# Altium schematic sheet usbaxe.SchDoc: USB-Axe
size A; DrawnBy: Evan Custodio; Engineer: Evan Custodio; DocumentNumber: RNG-0004; SheetNumber: 1; SheetTotal: 1
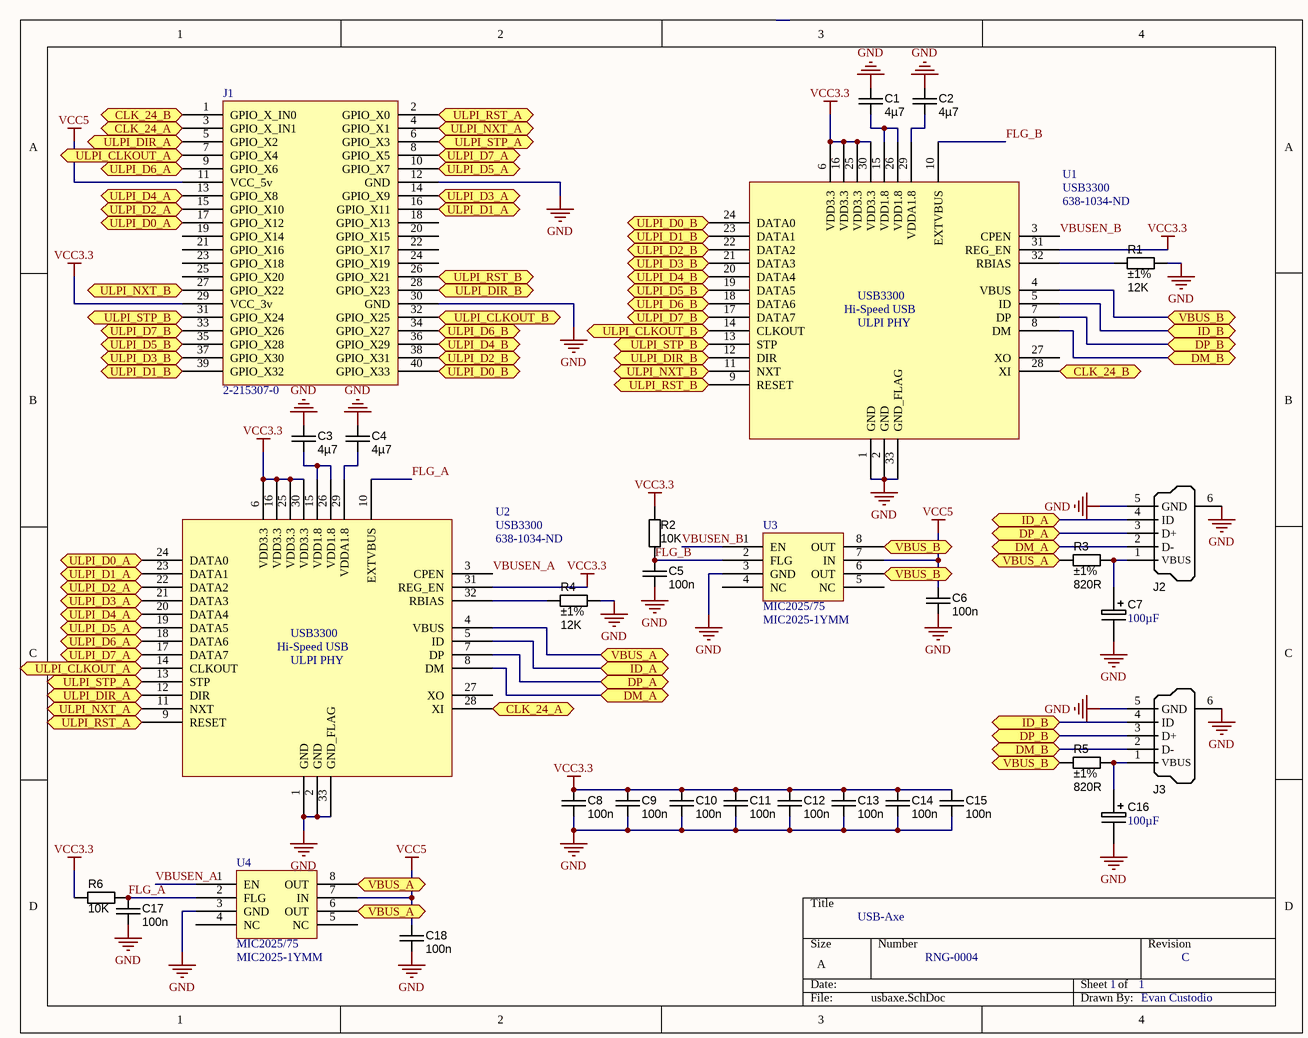
[diagram p0: usbaxe.SchDoc]

## Parts
?  RNGD_logo  (value not drawn)
C1  value 4µ7  [CAPC2012X135N]  (hidden comment: approved sub OK)
C2  value 4µ7  [CAPC2012X135N]  (hidden comment: approved sub OK)
C3  value 4µ7  [CAPC2012X135N]  (hidden comment: approved sub OK)
C4  value 4µ7  [CAPC2012X135N]  (hidden comment: approved sub OK)
C5  value 100n  [CAPC1608X90N]  (hidden comment: approved sub OK)
C6  value 100n  [CAPC1608X90N]  (hidden comment: approved sub OK)
C7  Capacitance: 100µF  [CAPMP3528X210N]
C8  value 100n  [CAPC1608X90N]  (hidden comment: approved sub OK)
C9  value 100n  [CAPC1608X90N]  (hidden comment: approved sub OK)
C10  value 100n  [CAPC1608X90N]  (hidden comment: approved sub OK)
C11  value 100n  [CAPC1608X90N]  (hidden comment: approved sub OK)
C12  value 100n  [CAPC1608X90N]  (hidden comment: approved sub OK)
C13  value 100n  [CAPC1608X90N]  (hidden comment: approved sub OK)
C14  value 100n  [CAPC1608X90N]  (hidden comment: approved sub OK)
C15  value 100n  [CAPC1608X90N]  (hidden comment: approved sub OK)
C16  Capacitance: 100µF  [CAPMP3528X210N]
C17  value 100n  [CAPC1608X90N]  (hidden comment: approved sub OK)
C18  value 100n  [CAPC1608X90N]  (hidden comment: approved sub OK)
J1  2-215307-0  [RCPT_40POS]
J2  USB_Mini-B_TH  [USB_MINI-B_WURTH-TH]  (value not drawn)
J3  USB_Mini-B_TH  [USB_MINI-B_WURTH-TH]  (value not drawn)
R1  value 12K  Tolerance: ±1%  [RESC1608X55N]  (hidden comment: Thick Film)
R2  value 10K  [RESC1608X55N]  (hidden comment: Thick Film)
R3  value 820R  Tolerance: ±1%  [RESC1608X55N]  (hidden comment: Thick Film)
R4  value 12K  Tolerance: ±1%  [RESC1608X55N]  (hidden comment: Thick Film)
R5  value 820R  Tolerance: ±1%  [RESC1608X55N]  (hidden comment: Thick Film)
R6  value 10K  [RESC1608X55N]  (hidden comment: Thick Film)
U1  USB3300  Supplier Part Number 1: 638-1034-ND  [USB3300_QFN32]
U2  USB3300  Supplier Part Number 1: 638-1034-ND  [USB3300_QFN32]
U3  MIC2025/75  Manufacturer Part Number: MIC2025-1YMM  [SOP65P490X102-8L30N]
U4  MIC2025/75  Manufacturer Part Number: MIC2025-1YMM  [SOP65P490X102-8L30N]

## Ports
CLK_24_A, CLK_24_B, DM_A, DM_B, DP_A, DP_B, ID_A, ID_B, ULPI_CLKOUT_A, ULPI_CLKOUT_B, ULPI_D0_A, ULPI_D0_B, ULPI_D1_A, ULPI_D1_B, ULPI_D2_A, ULPI_D2_B, ULPI_D3_A, ULPI_D3_B, ULPI_D4_A, ULPI_D4_B, ULPI_D5_A, ULPI_D5_B, ULPI_D6_A, ULPI_D6_B, ULPI_D7_A, ULPI_D7_B, ULPI_DIR_A, ULPI_DIR_B, ULPI_NXT_A, ULPI_NXT_B, ULPI_RST_A, ULPI_RST_B, ULPI_STP_A, ULPI_STP_B, VBUS_A, VBUS_B

## Nets
GND: C1.1 C2.1 C3.1 C4.1 C5.2 C6.2 C7.2 C8.2 C9.2 C10.2 C11.2 C12.2 C13.2 C14.2 C15.2 C16.2 C17.2 C18.2 J1.12(GND) J1.30(GND) J2.5(GND) J2.6(Shell) J3.5(GND) J3.6(Shell) R1.2 R4.2 U1.1(GND) U1.2(GND) U1.33(GND_FLAG) U2.1(GND) U2.2(GND) U2.33(GND_FLAG) U3.3(GND) U4.3(GND)
VCC3.3: C8.1 C9.1 C10.1 C11.1 C12.1 C13.1 C14.1 C15.1 J1.29(VCC_3v) R2.2 R6.1 U1.6(VDD3.3) U1.16(VDD3.3) U1.25(VDD3.3) U1.30(VDD3.3) U1.31(REG_EN) U2.6(VDD3.3) U2.16(VDD3.3) U2.25(VDD3.3) U2.30(VDD3.3) U2.31(REG_EN)
VCC5: C6.1 C18.1 J1.11(VCC_5v) U3.7(IN) U4.7(IN)
CLK_24_A: J1.3(GPIO_X_IN1) U2.28(XI) ; port CLK_24_A
CLK_24_B: J1.1(GPIO_X_IN0) U1.28(XI) ; port CLK_24_B
DM_A: J2.2(D-) U2.8(DM) ; port DM_A
DM_B: J3.2(D-) U1.8(DM) ; port DM_B
DP_A: J2.3(D+) U2.7(DP) ; port DP_A
DP_B: J3.3(D+) U1.7(DP) ; port DP_B
FLG_A: C17.1 R6.2 U2.10(EXTVBUS) U4.2(FLG)
FLG_B: C5.1 R2.1 U1.10(EXTVBUS) U3.2(FLG)
ID_A: J2.4(ID) U2.5(ID) ; port ID_A
ID_B: J3.4(ID) U1.5(ID) ; port ID_B
ULPI_CLKOUT_A: J1.7(GPIO_X4) U2.14(CLKOUT) ; port ULPI_CLKOUT_A
ULPI_CLKOUT_B: J1.32(GPIO_X25) U1.14(CLKOUT) ; port ULPI_CLKOUT_B
ULPI_D0_A: J1.17(GPIO_X12) U2.24(DATA0) ; port ULPI_D0_A
ULPI_D0_B: J1.40(GPIO_X33) U1.24(DATA0) ; port ULPI_D0_B
ULPI_D1_A: J1.16(GPIO_X11) U2.23(DATA1) ; port ULPI_D1_A
ULPI_D1_B: J1.39(GPIO_X32) U1.23(DATA1) ; port ULPI_D1_B
ULPI_D2_A: J1.15(GPIO_X10) U2.22(DATA2) ; port ULPI_D2_A
ULPI_D2_B: J1.38(GPIO_X31) U1.22(DATA2) ; port ULPI_D2_B
ULPI_D3_A: J1.14(GPIO_X9) U2.21(DATA3) ; port ULPI_D3_A
ULPI_D3_B: J1.37(GPIO_X30) U1.21(DATA3) ; port ULPI_D3_B
ULPI_D4_A: J1.13(GPIO_X8) U2.20(DATA4) ; port ULPI_D4_A
ULPI_D4_B: J1.36(GPIO_X29) U1.20(DATA4) ; port ULPI_D4_B
ULPI_D5_A: J1.10(GPIO_X7) U2.19(DATA5) ; port ULPI_D5_A
ULPI_D5_B: J1.35(GPIO_X28) U1.19(DATA5) ; port ULPI_D5_B
ULPI_D6_A: J1.9(GPIO_X6) U2.18(DATA6) ; port ULPI_D6_A
ULPI_D6_B: J1.34(GPIO_X27) U1.18(DATA6) ; port ULPI_D6_B
ULPI_D7_A: J1.8(GPIO_X5) U2.17(DATA7) ; port ULPI_D7_A
ULPI_D7_B: J1.33(GPIO_X26) U1.17(DATA7) ; port ULPI_D7_B
ULPI_DIR_A: J1.5(GPIO_X2) U2.12(DIR) ; port ULPI_DIR_A
ULPI_DIR_B: J1.28(GPIO_X23) U1.12(DIR) ; port ULPI_DIR_B
ULPI_NXT_A: J1.4(GPIO_X1) U2.11(NXT) ; port ULPI_NXT_A
ULPI_NXT_B: J1.27(GPIO_X22) U1.11(NXT) ; port ULPI_NXT_B
ULPI_RST_A: J1.2(GPIO_X0) U2.9(RESET) ; port ULPI_RST_A
ULPI_RST_B: J1.26(GPIO_X21) U1.9(RESET) ; port ULPI_RST_B
ULPI_STP_A: J1.6(GPIO_X3) U2.13(STP) ; port ULPI_STP_A
ULPI_STP_B: J1.31(GPIO_X24) U1.13(STP) ; port ULPI_STP_B
VBUS_A: R3.1 U2.4(VBUS) U4.6(OUT) U4.8(OUT) ; port VBUS_A
VBUS_B: R5.1 U1.4(VBUS) U3.6(OUT) U3.8(OUT) ; port VBUS_B
VBUSEN_A: U2.3(CPEN) U4.1(EN)
VBUSEN_B: U1.3(CPEN) U3.1(EN)
NetC1_2: C1.2 U1.15(VDD1.8) U1.26(VDD1.8)
NetC2_2: C2.2 U1.29(VDDA1.8)
NetC3_2: C3.2 U2.15(VDD1.8) U2.26(VDD1.8)
NetC4_2: C4.2 U2.29(VDDA1.8)
NetC7_1: C7.1 J2.1(VBUS) R3.2
NetC16_1: C16.1 J3.1(VBUS) R5.2
NetR1_1: R1.1 U1.32(RBIAS)
NetR4_1: R4.1 U2.32(RBIAS)

Not connected (* = marked no-connect by the designer): J1 18(GPIO_X13) 19(GPIO_X14) 20(GPIO_X15) 21(GPIO_X16) 22(GPIO_X17) 23(GPIO_X18) 24(GPIO_X19) 25(GPIO_X20); U1 27(XO); U2 27(XO); U3 4(NC) 5(NC); U4 4(NC) 5(NC)

## Notes on the sheet
- C
- (in symbol USB3300) Hi-Speed USB; ULPI PHY

## Library data of the parts
C1-C4 = CAPC_4u7_0805: Capacitor SMD Cer 4.7uF 10% 16V X5R 0805; Manufacturer 1: Taiyo Yuden; Manufacturer Part Number 1: EMK212BJ475KG-T; Ratings: 16V; X5R; Material: ceramic; SCDType: spec; Package / Case: 0805 (2012 Metric); Tolerance: ±10%; Supplier 1: Digi-Key; Supplier Part Number 1: 587-1294-1-ND; Operating Temperature: -55°C ~ 85°C; Size / Dimension: 0.079" L x 0.049" W (2.00mm x 1.25mm); Thickness (Max): 0.053" (1.35mm); ComponentLink1URL: http://www.yuden.co.jp/productdata/catalog/en/mlcc01_e.pdf; ComponentLink1Description: http://www.yuden.co.jp/productdata/catalog/en/mlcc01_e.pdf; Supplier 2: Digi-Key; Supplier Part Number 2: 1276-1065-1-ND; Manufacturer 2: Samsung Electro-Mechanics America, Inc; Manufacturer Part Number 2: CL21A475KOFNNNE; RoHS 2: RoHS Compliant; ComponentLink2URL: http://www.samsungsem.com/servlet/FileDownload?type=spec&file=CL21A475KOFNNNE.pdf; ComponentLink2Description: http://www.samsungsem.com/servlet/FileDownload?type=spec&file=CL21A475KOFNNNE.pdf; Supplier 3: Digi-Key; Supplier Part Number 3: 399-8101-1-ND; Manufacturer 3: Kemet; Manufacturer Part Number 3: C0805C475K4PACTU; RoHS 3: RoHS Compliant; ComponentLink3URL: http://capacitoredge.kemet.com/capedge2/DataSheet?pn=C0805C475K4PACTU; ComponentLink3Description: http://capacitoredge.kemet.com/capedge2/DataSheet?pn=C0805C475K4PACTU; Supplier 4: Digi-Key; Supplier Part Number 4: 490-7215-1-ND; Manufacturer 4: Murata Electronics North America; Manufacturer Part Number 4: GRM21BR61C475MA88L; RoHS 4: RoHS Compliant; ComponentLink4URL: http://psearch.murata.com/capacitor/product/GRM21BR61C475MA88#.pdf; ComponentLink4Description: http://psearch.murata.com/capacitor/product/GRM21BR61C475MA88#.pdf; Supplier 5: Digi-Key; Supplier Part Number 5: 445-7640-1-ND; Manufacturer 5: TDK Corporation; Manufacturer Part Number 5: C2012X5R1C475K125AC; RoHS 5: RoHS Compliant; ComponentLink5URL: http://product.tdk.com/capacitor/mlcc/en/documents/mlcc_commercial_general_en.pdf; ComponentLink5Description: http://product.tdk.com/capacitor/mlcc/en/documents/mlcc_commercial_general_en.pdf; RoHS 1: RoHS Compliant
C5 C6 C8-C15 C17 C18 = CAPC_100n_0603_X7R_50V_10%: Capacitor SMD Cer 100nF 10% 50V X7R 0603; Manufacturer 1: AVX Corporation; Manufacturer Part Number 1: 06035C104KAT2A; Ratings: 50V; X7R; Material: ceramic; SCDType: spec; Manufacturer 2: TDK Corporation; Manufacturer Part Number 2: C1608X7R1H104K; Package / Case: 0603 (1608 Metric); Tolerance: ±10%; Supplier 1: Digi-Key; Supplier Part Number 1: 478-5052-1-ND; ComponentLink1URL: http://www.avx.com/docs/Catalogs/cx7r.pdf; ComponentLink1Description: http://www.avx.com/docs/Catalogs/cx7r.pdf; Supplier 2: Digi-Key; Supplier Part Number 2: 445-1314-1-ND; ComponentLink2URL: http://product.tdk.com/capacitor/mlcc/en/documents/mlcc_commercial_general_en.pdf; ComponentLink2Description: http://product.tdk.com/capacitor/mlcc/en/documents/mlcc_commercial_general_en.pdf
C7 C16 = CAPT_100u_1210_10V: Capacitor SMD Tantalum 100uF 20% 10V 1210; Manufacturer: AVX Corporation; Manufacturer Part Number: TPSB107M010R0400; Manufacturer Size Code: B; ESR (Equivalent Series Resistance): 400 mOhm; Type: Molded; Supplier 1: Digi-Key; RoHS: RoHS Compliant; Category: Capacitors; Stock 1: 35829; Pricing 1: 1=1.2, 10=1.001, 100=0.639, 250=0.53252, 500=0.47926, 1000=0.43665 (USD); Packaging: Cut Tape (CT); Tolerance: ±20%; Voltage - Rated: 10V; Operating Temperature: -55°C ~ 125°C; Mounting Type: Surface Mount; Package / Case: 1210 (3528 Metric); Size / Dimension: 0.138" L x 0.110" W (3.50mm x 2.80mm); Height - Seated (Max): 0.083" (2.10mm); Lead Spacing: -; Features: General Purpose; Lifetime @ Temp.: -; ComponentLink1URL: http://www.avx.com/docs/Catalogs/tps.pdf; ComponentLink1Description: http://www.avx.com/docs/Catalogs/tps.pdf; Supplier Part Number 1: 478-5231-1-ND
J1 = 2-215307-0: CONN RCPT 40POS VERT T/H; Manufacturer: TE Connectivity AMP Connectors; Connector Type: Receptacle; Number of Positions: 40; Number of Positions Loaded: All; Pitch: 0.100" (2.54mm); Supplier 1: Digi-Key; Manufacturer Part Number: 2-215307-0; RoHS: RoHS Compliant; Category: Connectors, Interconnects; Stock 1: 345; Pricing 1: 1=4.65, 25=4.18, 50=3.94, 100=3.47, 500=3.36 (USD); Packaging: Bulk; Number of Rows: 2; Row Spacing: 0.100" (2.54mm); Height Stacking (Mating): -; Height Above Board: 0.275" (7.00mm); Mounting Type: Through Hole; Termination: Press-Fit; Contact Finish: Gold; Contact Finish Thickness: 31.5µin (0.80µm); Features: -; Color: Green; ComponentLink1URL: http://www.te.com/commerce/DocumentDelivery/DDEController?Action=srchrtrv&DocNm=215307&DocType=Customer+Drawing&DocLang=English; ComponentLink1Description: http://www.te.com/commerce/DocumentDelivery/DDEController?Action=srchrtrv&DocNm=215307&DocType=Customer+Drawing&DocLang=English
J2 J3 = USB_Mini-B_TH: Connector TH USB Type Mini-B; Manufacturer: Wurth Electronics Inc; Manufacturer Part Number: 651005136521; Connector Type: USB - mini B; Number of Contacts: 5; Gender: Receptacle; Supplier 1: Digi-Key; RoHS: RoHS Compliant; Category: Connectors, Interconnects; Stock 1: 3626; Pricing 1: 1=2.44, 10=2.113, 100=1.9906, 250=1.78752, 500=1.625 (USD); Packaging: Tube; Specifications: -; Mounting Type: Through Hole, Right Angle, Horizontal; Features: Board Guide, Shielded; Ingress Protection: -; ComponentLink1URL: http://katalog.we-online.de/em/datasheet/651005136521.pdf; ComponentLink1Description: http://katalog.we-online.de/em/datasheet/651005136521.pdf
R1 R4 = RES_12K_0603_1%: Resistor SMD chip 12k Ohm 0.1W 1% 0603; Manufacturer: Yageo; Manufacturer Part Number: RC0603FR-0712KL; Ratings: 1/10W; SCDType: spec; Power (Watts): 0.1W, 1/10W; Temperature Coefficient: ±100ppm/°C; Package / Case: 0603 (1608 Metric); RoHS: RoHS Compliant; Category: Resistors; Stock 2: 517125; Pricing 2: 1=0.1, 10=0.014, 25=0.01, 100=0.0057, 250=0.00436, 500=0.00348, 1000=0.00257, 2500=0.00223 (USD); Packaging: Cut Tape (CT); Resistance (Ohms): 12k; Composition: Thick Film; Features: Moisture Resistant; Operating Temperature: -55°C ~ 155°C; Supplier Device Package: 0603; Size / Dimension: 0.063" L x 0.031" W (1.60mm x 0.80mm); Height: 0.022" (0.55mm); Number of Terminations: 2; ComponentLink1URL: http://www.yageo.com/documents/recent/PYu-RC_Group_51_RoHS_L_2.pdf; ComponentLink1Description: http://www.yageo.com/documents/recent/PYu-RC_Group_51_RoHS_L_2.pdf; Supplier: Digi-Key; Supplier Part Number: 311-12.0KHRCT-ND
R2 R6 = RES_10K_0603_5%: Resistor SMD chip 10k Ohm 0.1W 5% 0603; Manufacturer 1: Yageo; Manufacturer Part Number 1: RC0603JR-0710KL; Ratings: 1/10 W; SCDType: spec; Package / Case: 0603 (1608 metric); Tolerance: ±5%; Material: Thick Film; Supplier 1: Digi-Key; Supplier Part Number 1: 311-10KGRCT-ND; Supplier 2: Digi-Key; Supplier Part Number 2: 541-10KGCT-ND; Manufacturer 2: Vishay Dale; Manufacturer Part Number 2: CRCW060310K0JNEA; ComponentLink2URL: http://www.vishay.com/doc?20035; ComponentLink2Description: http://www.vishay.com/doc?20035; ComponentLink1URL: http://www.yageo.com/documents/recent/PYu-RC0603_51_RoHS_L_4.pdf; ComponentLink1Description: http://www.yageo.com/documents/recent/PYu-RC0603_51_RoHS_L_4.pdf
R3 R5 = RES_820R_0603_1%: Resistor SMD chip 820 Ohm 0.1W 1% 0603; Manufacturer Part Number 1: RC0603FR-07820RL; Manufacturer 1: Yageo; Ratings: 1/10W; SCDType: undef; Package / Case: 0603 (1608 Metric); Supplier 1: Digi-Key; Supplier Part Number 1: 311-820HRCT-ND
U1 U2 = USB3300: USB 2.0 ULPI PHY; Manufacturer: Microchip Technology; Manufacturer Part Number: USB3300-EZK; Function: Controller; Standards: USB 2.0, OTG; Voltage - Supply: 3 V ~ 3.6 V; Supplier 1: Digi-Key; RoHS: RoHS Compliant; Category: Integrated Circuits (ICs); Stock 1: 13960; Pricing 1: 1=1.49, 10=1.24, 25=1.04, 100=0.94 (USD); Packaging: Tray; Protocol: USB; Interface: ULPI; Current - Supply: -; Operating Temperature: 0°C ~ 85°C; Package / Case: 32-VFQFN Exposed Pad; Supplier Device Package: 32-QFN (5x5); ComponentLink1URL: http://www.microchip.com/mymicrochip/filehandler.aspx?ddocname=en562663; ComponentLink1Description: http://www.microchip.com/mymicrochip/filehandler.aspx?ddocname=en562663
U3 U4 = MIC2025/75: Manufacturer: Micrel Inc; Switch Type: General Purpose; Number of Outputs: 1; Ratio - Input:Output: 1:1; Output Configuration: High Side; Output Type: N-Channel; Interface: On/Off; Voltage - Load: 2.7 V ~ 5.5 V; Voltage - Supply (Vcc/Vdd): Not Required; Current - Output (Max): 500mA; Rds On (Typ): 90 mOhm; Input Type: Non-Inverting; Fault Protection: Current Limiting (Fixed), Over Temperature, UVLO; Supplier 1: Digi-Key; RoHS: RoHS Compliant; Category: Integrated Circuits (ICs); Stock 1: 2033; Pricing 1: 1=0.96, 10=0.84, 25=0.744, 100=0.648, 250=0.564, 500=0.48, 1000=0.384, 2500=0.348 (USD); Packaging: Tube; Features: Slew Rate Controlled, Status Flag; Operating Temperature: -40°C ~ 85°C (TA); Package / Case: 8-TSSOP, 8-MSOP (0.118", 3.00mm Width); ComponentLink1URL: http://www.micrel.com/_PDF/mic2025.pdf; ComponentLink1Description: http://www.micrel.com/_PDF/mic2025.pdf; Supplier Part Number 1: 576-1691-5-ND